# Altium schematic sheet Interfaces.SchDoc
size A4
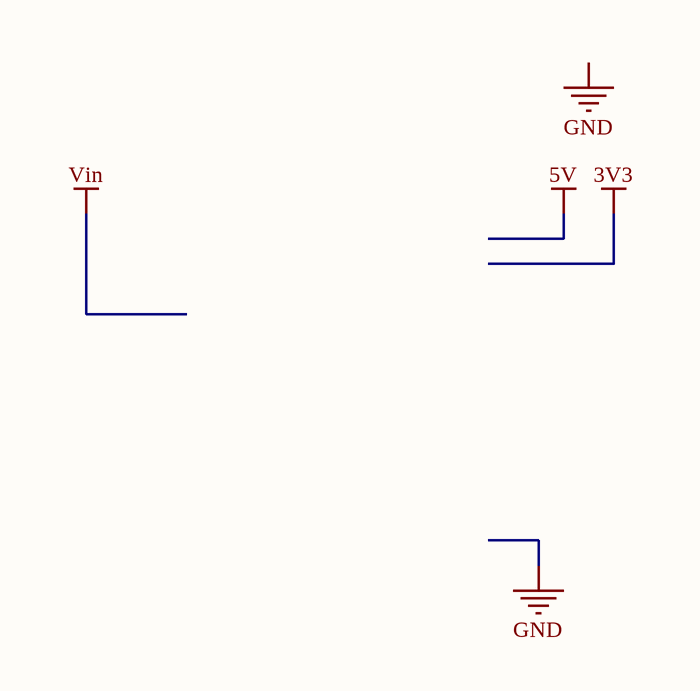
[diagram p0: Interfaces.SchDoc]

## Notes on the sheet
- Labels drawn without touching a wire or pin: GND